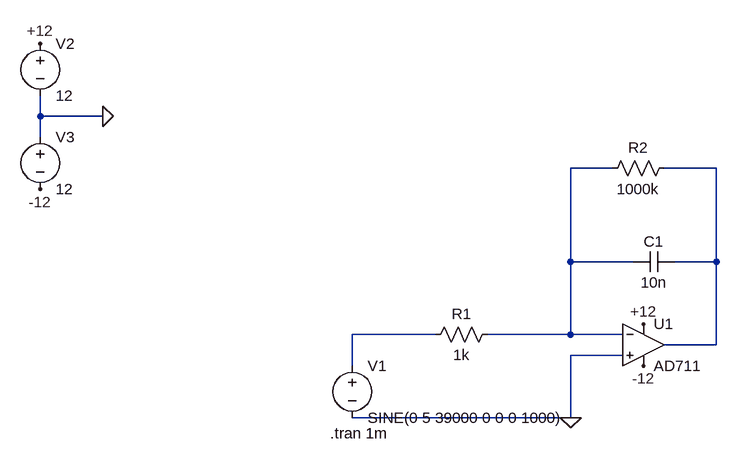
[diagram p0: schematic Montage 2.asc]
Montage 2.asc, the LTspice schematic file:
Version 4
SHEET 1 880 680
WIRE -560 -80 -560 -112
WIRE -464 -80 -560 -80
WIRE -560 -48 -560 -80
WIRE 320 0 256 0
WIRE 480 0 400 0
WIRE 256 144 256 0
WIRE 352 144 256 144
WIRE 480 144 480 0
WIRE 480 144 416 144
WIRE 48 256 -80 256
WIRE 256 256 256 144
WIRE 256 256 128 256
WIRE 336 256 256 256
WIRE 480 272 480 144
WIRE 480 272 400 272
WIRE 336 288 256 288
WIRE -80 304 -80 256
WIRE 256 384 256 288
WIRE 256 384 -80 384
FLAG 256 384 0
FLAG 368 240 +12
FLAG 368 304 -12
FLAG -560 -192 +12
FLAG -560 32 -12
FLAG -464 -80 0
SYMBOL res 144 240 R90
WINDOW 0 0 56 VBottom 2
WINDOW 3 32 56 VTop 2
SYMATTR InstName R1
SYMATTR Value 1k
SYMBOL voltage -80 288 R0
WINDOW 123 0 0 Left 0
WINDOW 39 0 0 Left 0
SYMATTR InstName V1
SYMATTR Value SINE(0 5 39000 0 0 0 1000)
SYMBOL OpAmps\\AD711 368 208 R0
SYMATTR InstName U1
SYMBOL res 416 -16 R90
WINDOW 0 0 56 VBottom 2
WINDOW 3 32 56 VTop 2
SYMATTR InstName R2
SYMATTR Value 1000k
SYMBOL cap 416 128 R90
WINDOW 0 0 32 VBottom 2
WINDOW 3 32 32 VTop 2
SYMATTR InstName C1
SYMATTR Value 10n
SYMBOL voltage -560 -64 R0
WINDOW 123 0 0 Left 0
WINDOW 39 0 0 Left 0
SYMATTR InstName V3
SYMATTR Value 12
SYMBOL voltage -560 -208 R0
WINDOW 123 0 0 Left 0
WINDOW 39 0 0 Left 0
SYMATTR InstName V2
SYMATTR Value 12
TEXT -114 408 Left 2 !.tran 1m

The netlist it stands for:
* Montage 2.asc
R1 N001 N003 1k
V1 N003 0 SINE(0 5 39000 0 0 0 1000)
XU1 0 N001 +12 -12 N002 AD712  ; AD711, pins In+ In- V+ V- OUT
R2 N002 N001 1000k
C1 N002 N001 10n
V3 0 -12 12
V2 +12 0 12
.tran 1m
.lib ADI1.lib
.backanno
.end